# EAGLE design untitled (EAGLE 7.3.0)
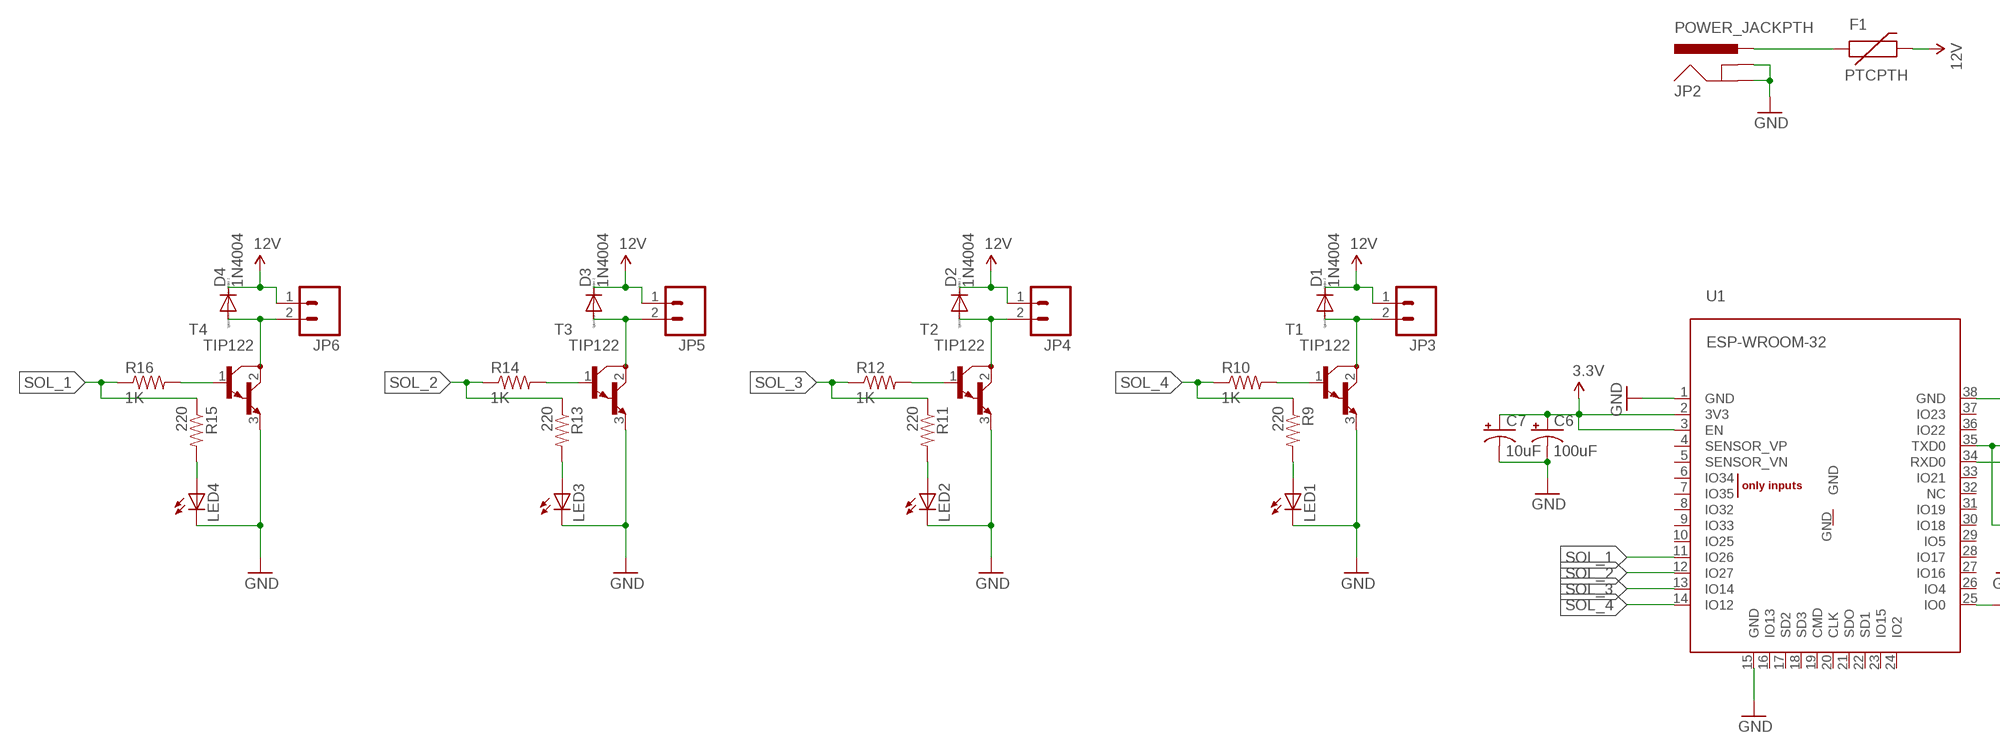
[diagram p0: schematic, sheet 1, part 1 of 2]
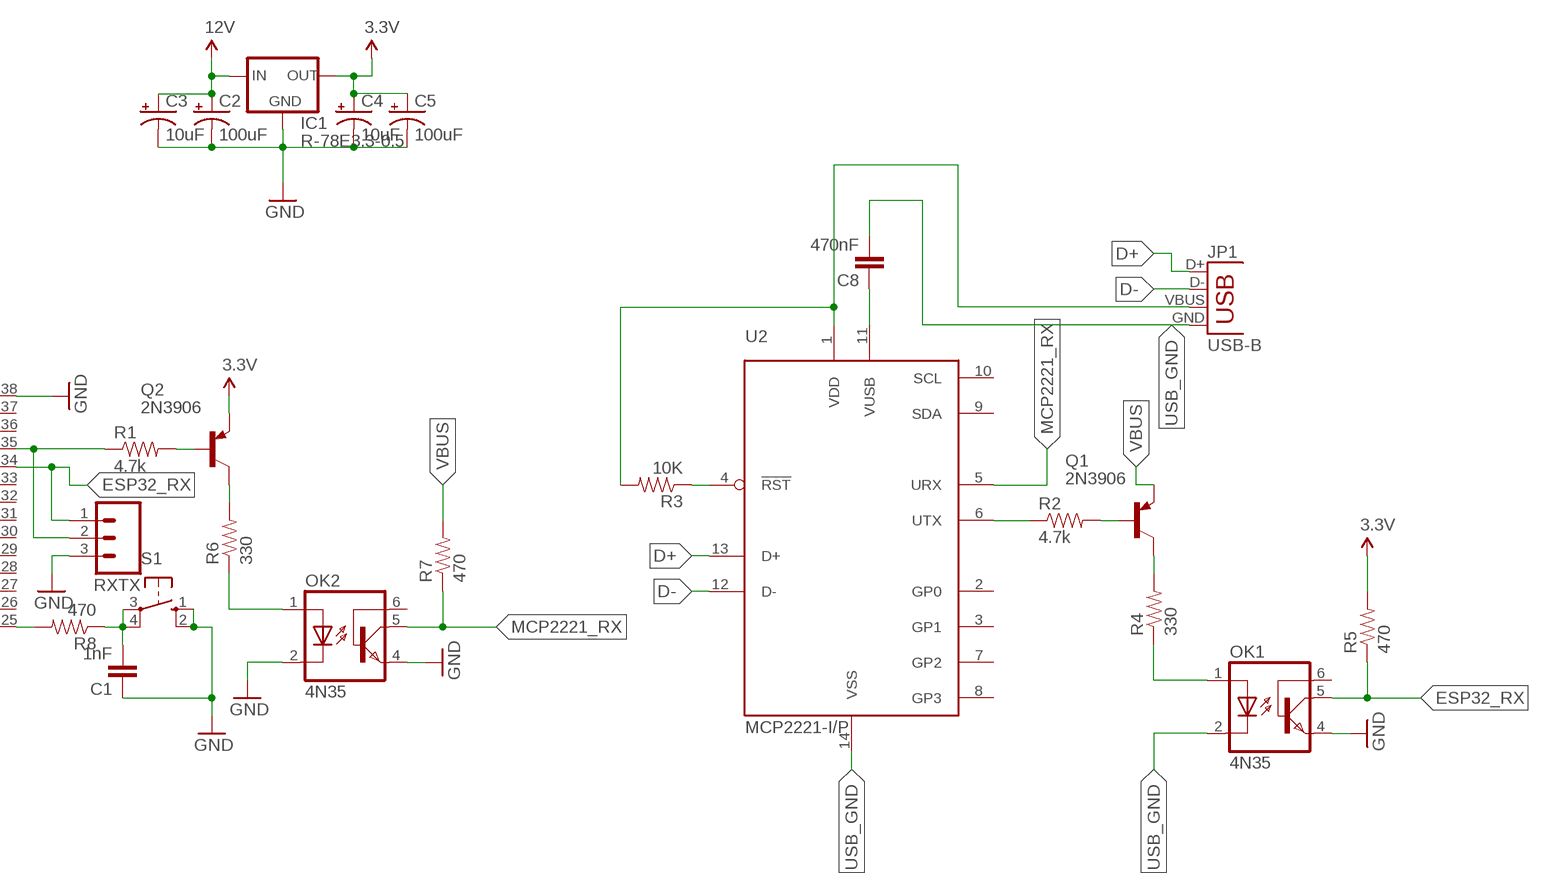
[diagram p1: schematic, sheet 1, part 2 of 2]

## Parts
C1  1nF  CAPKIT  [CAP-PTH-SMALL-KIT]
C2  100uF  CAP_POLPTH1  [CPOL-RADIAL-100UF-25V]
C3  10uF  CAP_POLPTH1  [CPOL-RADIAL-100UF-25V]
C4  10uF  CAP_POLPTH1  [CPOL-RADIAL-100UF-25V]
C5  100uF  CAP_POLPTH1  [CPOL-RADIAL-100UF-25V]
C6  100uF  CAP_POLPTH1  [CPOL-RADIAL-100UF-25V]
C7  10uF  CAP_POLPTH1  [CPOL-RADIAL-100UF-25V]
C8  470nF  CAPEZ  [CAP-PTH-SMALLEZ]
D1  1N4004  [DO41-10]
D2  1N4004  [DO41-10]
D3  1N4004  [DO41-10]
D4  1N4004  [DO41-10]
F1  PTCPTH  [PTC]
IC1  R-78E3.3-0.5  [SIP3]
JP1  USB-B  USBPTH  [USB-B-PTH]
JP2  POWER_JACKPTH  [POWER_JACK_PTH]
JP3  M02LOCK_LONGPADS  [1X02_LOCK_LONGPADS]
JP4  M02LOCK_LONGPADS  [1X02_LOCK_LONGPADS]
JP5  M02LOCK_LONGPADS  [1X02_LOCK_LONGPADS]
JP6  M02LOCK_LONGPADS  [1X02_LOCK_LONGPADS]
LED1  LED3MM  [LED3MM]
LED2  LED3MM  [LED3MM]
LED3  LED3MM  [LED3MM]
LED4  LED3MM  [LED3MM]
OK1  4N35  [DIL06]
OK2  4N35  [DIL06]
Q1  2N3906  [TO92]
Q2  2N3906  [TO92]
R1  4.7k  RESISTORAXIAL-0.3  [AXIAL-0.3]
R2  4.7k  RESISTORAXIAL-0.3  [AXIAL-0.3]
R3  10K  RESISTORAXIAL-0.3  [AXIAL-0.3]
R4  330  RESISTORAXIAL-0.3  [AXIAL-0.3]
R5  470  RESISTORAXIAL-0.3  [AXIAL-0.3]
R6  330  RESISTORAXIAL-0.3  [AXIAL-0.3]
R7  470  RESISTORAXIAL-0.3  [AXIAL-0.3]
R8  470  RESISTORAXIAL-0.3  [AXIAL-0.3]
R9  220  RESISTORAXIAL-0.3  [AXIAL-0.3]
R10  1K  RESISTORAXIAL-0.3  [AXIAL-0.3]
R11  220  RESISTORAXIAL-0.3  [AXIAL-0.3]
R12  1K  RESISTORAXIAL-0.3  [AXIAL-0.3]
R13  220  RESISTORAXIAL-0.3  [AXIAL-0.3]
R14  1K  RESISTORAXIAL-0.3  [AXIAL-0.3]
R15  220  RESISTORAXIAL-0.3  [AXIAL-0.3]
R16  1K  RESISTORAXIAL-0.3  [AXIAL-0.3]
RXTX  M03LONGPADS  [1X03_LONGPADS]
S1  10-XX  [B3F-10XX]
T1  TIP122  [TO220]
T2  TIP122  [TO220]
T3  TIP122  [TO220]
T4  TIP122  [TO220]
U1  ESP-WROOM-32  [ESP-WROOM-32]
U2  MCP2221-I/P  [DIL14]

## Nets
3.3V: C4.1(+) C5.1(+) C6.1(+) C7.1(+) IC1.3(OUT) Q2.3(E) R5.P$2 U1.2(3V3) U1.3(EN)
12V: C2.1(+) C3.1(+) D1.C D2.C D3.C D4.C F1.P$2 IC1.1(IN) JP3.1 JP4.1 JP5.1 JP6.1
D+: JP1.D+ U2.13(D+)
D-: JP1.D- U2.12(D-)
ESP32_RX: OK1.5(COL) R5.P$1 RXTX.1 U1.34(RXD0)
GND: C1.1 C2.2(-) C3.2(-) C4.2(-) C5.2(-) C6.2(-) C7.2(-) IC1.2(GND) JP2.GND JP2.GNDBREAK LED1.K(C) LED2.K(C) LED3.K(C) LED4.K(C) OK1.4(EMI) OK2.2(C) OK2.4(EMI) RXTX.3 S1.1(S) S1.2(S1) T1.3(E) T2.3(E) T3.3(E) T4.3(E) U1.1(GND) U1.15(GND) U1.38(GND)
MCP2221_RX: OK2.5(COL) R7.P$1 U2.5(URX)
N$1: Q1.1(C) R4.P$2
N$2: R1.P$1 RXTX.2 U1.35(TXD0)
N$3: C8.1 U2.11(VUSB)
N$4: Q2.2(B) R1.P$2
N$5: R3.P$1 U2.4(!RST)
N$6: R2.P$1 U2.6(UTX)
N$7: Q1.2(B) R2.P$2
N$8: OK1.1(A) R4.P$1
N$9: Q2.1(C) R6.P$2
N$10: OK2.1(A) R6.P$1
N$12: R8.P$2 U1.25(IO0)
N$13: D1.A JP3.2 T1.2(C)
N$14: LED1.A R9.P$2
N$15: R10.P$2 T1.1(B)
N$16: D2.A JP4.2 T2.2(C)
N$17: LED2.A R11.P$2
N$18: R12.P$2 T2.1(B)
N$19: D3.A JP5.2 T3.2(C)
N$20: LED3.A R13.P$2
N$21: R14.P$2 T3.1(B)
N$22: D4.A JP6.2 T4.2(C)
N$23: LED4.A R15.P$2
N$24: R16.P$2 T4.1(B)
N$25: F1.P$1 JP2.PWR
RXTX: C1.2 R8.P$1 S1.3(P) S1.4(P1)
SOL_1: R15.P$1 R16.P$1 U1.11(IO26)
SOL_2: R13.P$1 R14.P$1 U1.12(IO27)
SOL_3: R11.P$1 R12.P$1 U1.13(IO14)
SOL_4: R9.P$1 R10.P$1 U1.14(IO12)
USB_GND: C8.2 JP1.GND OK1.2(C) U2.14(VSS)
VBUS: JP1.VBUS Q1.3(E) R3.P$2 R7.P$2 U2.1(VDD)
Unconnected: OK1.6(BAS) OK2.6(BAS) U1.4(SENSOR_VP) U1.5(SENSOR_VN) U1.6(IO34) U1.7(IO35) U1.8(IO32) U1.9(IO33) U1.10(IO25) U1.16(IO13) U1.17(SD2) U1.18(SD3) U1.19(CMD) U1.20(CLK) U1.21(SDO) U1.22(SD1) U1.23(IO15) U1.24(IO2) U1.26(IO4) U1.27(IO16) U1.28(IO17) U1.29(IO5) U1.30(IO18) U1.31(IO19) U1.32(NC) U1.33(IO21) U1.36(IO22) U1.37(IO23) U1.GND U2.2(GP0) U2.3(GP1) U2.7(GP2) U2.8(GP3) U2.9(SDA) U2.10(SCL)

## Library data of the parts
C1 = SparkFun:CAP: Capacitor Standard 0603 ceramic capacitor, and 0.1" leaded capacitor.
C2-C7 = SparkFun:CAP_POL: Capacitor Polarized These are standard SMD and PTH capacitors. Normally 10uF, 47uF, and 100uF in electrolytic and tantalum varieties. Always verify the external diameter of the through hole cap, it varies with capacity, voltage, and manufacturer. The EIA devices should be standard.
C8 = SparkFun-Capacitors:CAP: Capacitor Standard 0603 ceramic capacitor, and 0.1" leaded capacitor.; MF: MULTICOMP; MPN: MCBU5471K5; OC_FARNELL: 9411771
D1-D4 = diode:1N4004: DIODE general purpose rectifier, 1 A
F1 = SparkFun:PTC: Resettable Fuse PTC Resettable Fuse. Spark Fun Electronics SKU : COM-08357
IC1 = r-78xx_10:R-78E*-0.5: Innoline R-78xx-0.5 Series Switching Regulators - 0.5A, Low Cost Source: http://www.recom-international.com/pdf/Innoline/R-78Exx-0.5.pdf; MF: Recom; MPN: R-783.3-0.5; OC_FARNELL: unknown; OC_NEWARK: 62X9498
JP1 = SparkFun-Connectors:USB: USB Connectors USB-B-PTH is fully proven SKU : PRT-00139/CONN-08278 USB-miniB is fully proven SKU : PRT-00587 USB-A-PCB is untested. USB-A-H is throughly reviewed, but untested. Spark Fun Electronics SKU : PRT-00437 USB-B-SMT is throughly reviewed, but untested. Needs silkscreen touching up. USB-A-S has not been used/tested USB-MB-H has not been used/tested USB-MICROB has been used. CONN-09505; MF: MULTICOMP; MPN: USB-B-S-RA.; OC_FARNELL: 1626770; PROD_ID: CONN-08278
JP2 = SparkFun-Connectors:POWER_JACK: Power Jack This is the standard 5.5mm barrel jack for power. The PTH is the most common, proven, reliable, footprint. The Slot footprint only works if the mill layer is transmitted to the PCB fab house so be warned. Mating wall wart : TOL-00298 (and others); MF: CLIFF ELECTRONIC COMPONENTS; MPN: DC10A; OC_FARNELL: 224959; PROD_ID: CONN-08197
JP3-JP6 = SparkFun:M02: Header 2 Standard 2-pin 0.1" header. Use with straight break away headers (SKU : PRT-00116), right angle break away headers (PRT-00553), swiss pins (PRT-00743), machine pins (PRT-00117), and female headers (PRT-00115). Molex polarized connector foot print use with SKU : PRT-08233 with associated crimp pins and housings.
LED1-LED4 = SparkFun:LED: LEDs Standard schematic elements and footprints for 5mm, 3mm, 1206, and 0603 sized LEDs. 5mm - Spark Fun Electronics SKU : COM-00529 (and others)
OK1 OK2 = optocoupler:4N35: MOTOROLA OPTO COUPLER; MF: VISHAY; MPN: 4N35; OC_FARNELL: 1328375; OC_NEWARK: 72K9946
Q1 Q2 = transistor-pnp:2N3906: PNP Transistor; MF: MULTICOMP; MPN: 2N3906; OC_FARNELL: 1574372
R1 R2 = SparkFun-Resistors:RESISTOR: Resistor Basic schematic elements and footprints for 0603, 1206, and PTH resistors.; MF: MULTICOMP; MPN: MCRE000045; OC_FARNELL: 1700245
R3 = SparkFun-Resistors:RESISTOR: Resistor Basic schematic elements and footprints for 0603, 1206, and PTH resistors.; MF: MULTICOMP; MPN: MCMF006FF1002A50; OC_FARNELL: 2401780
R4 R6 = SparkFun-Resistors:RESISTOR: Resistor Basic schematic elements and footprints for 0603, 1206, and PTH resistors.; MF: MULTICOMP; MPN: MCRE000031; OC_FARNELL: 1700230
R5 R7-R16 = SparkFun-Resistors:RESISTOR: Resistor Basic schematic elements and footprints for 0603, 1206, and PTH resistors.; MF: MULTICOMP; MPN: MCRE000033; OC_FARNELL: 1700232
RXTX = SparkFun:M03: Header 3 Standard 3-pin 0.1" header. Use with straight break away headers (SKU : PRT-00116), right angle break away headers (PRT-00553), swiss pins (PRT-00743), machine pins (PRT-00117), and female headers (PRT-00115). Molex polarized connector foot print use with SKU : PRT-08232 with associated crimp pins and housings.
S1 = switch-omron:10-XX: OMRON SWITCH; MPN: B3F-1000; OC_FARNELL: 176432; OC_NEWARK: 36M3542
T1-T4 = transistor:TIP122: NPN BIPOLAR DARLINGTON TRANSISTOR
U1 = esp32:ESP-WROOM-32
U2 = microchip-mcp2221:MCP2221-*: MCP2221 in PDIP, SOIC and TSSOP package The MCP2221 is a USB-to-UART/I2C serial converter which enables USB connectivity in applications that have a UART and I2C interfaces. The device reduces external components by integrating the USB termination resistors and the oscillator needed for USB operation. The MCP2221 also has four GP pins providing miscellaneous functionalities (GPIO, USBCFG, SSPND, Clock Output, ADC, DAC, interrupt detector). Source: www.microchip.com/MCP2221 <http://www.microchip.com/wwwproducts/Devices.aspx?product=MCP2221> and www.microchipdirect.com <http://www.microchipdirect.com/ProductDetails.aspx?Category=MCP2221> Tutorial: MCP2221 by Arnauld Biganzoli <https://docs.google.com/document/d/1P3zzqCKdEXzCe--1Yyg8PClCZKsUri8pyNO7AV2daaw/edit?usp=sharing>; MF: MICROCHIP; MPN: MCP2221-I/P; OC_FARNELL: 2434892

## Board
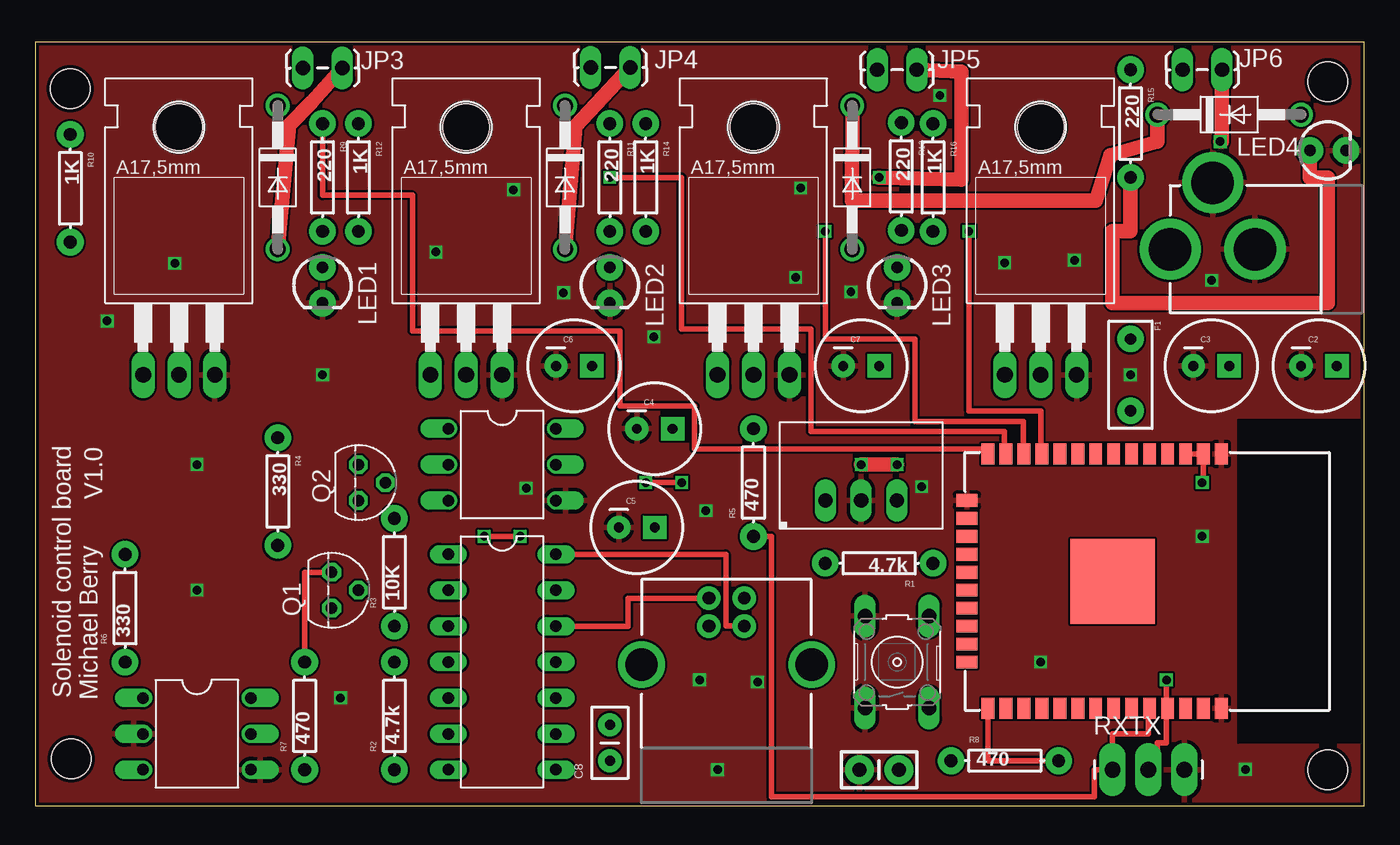
[diagram p2: board, top side]
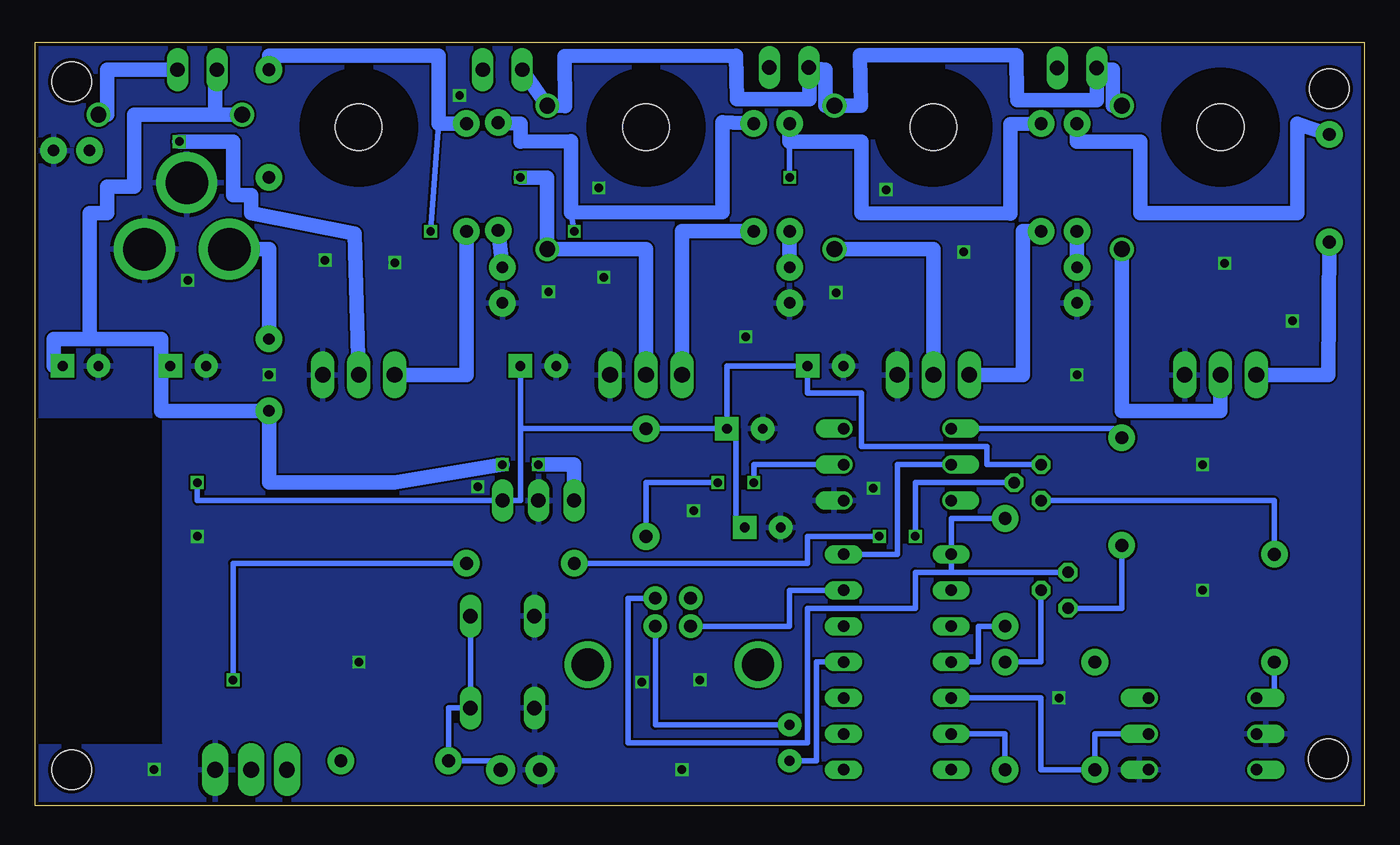
[diagram p3: board, bottom side, seen from below]

Size 94 x 54 mm. Coordinates in mm from the lower left corner, seen from the top.
Outline: 0,0 94,0 94,54 0,54 0,0
Copper layers (1*16): Top 0.035mm / dielectric 1.5mm / Bottom 0.035mm
Design rules "SeeedStudio_2layer_DRU_no_angle_20140221": minimum track width 6mil, minimum drill 12mil, track to track 6mil, track to pad 6mil, pad to pad 6mil, via to via 6mil, smd to smd 0mil, copper to edge 10mil, drill to drill 10mil, minimum pad ring 10mil, minimum via ring 6mil, stop-mask expansion 2mil, vias tented up to drill 100mil, thermal gap 10mil
Holes 2.8 mm at 2.47,50.74 2.54,3.31 91.44,2.54 91.44,51.23

### Footprints (pad centres in the part's own frame; a part is rotated, then mirrored left to right if it is on the bottom)
CAP-PTH-SMALL-KIT = drill 1.016 pad 2.032: 1 -1.397,0; 2 1.397,0
CPOL-RADIAL-100UF-25V = drill 0.7 pad 1.651 square: 1 1.27,0 | drill 0.7 pad 1.651: 2 -1.27,0
CAP-PTH-SMALLEZ = drill 0.7 pad 1.651: 1 0,0; 2 2.54,0
DO41-10 = drill 1.118: A 5.08,0; C -5.08,0
PTC = drill 0.8 pad 1.88: P$1 -2.54,0; P$2 2.54,0
SIP3 = drill 1 long: 1 -2.54,0; 2 0,0; 3 2.54,0
USB-B-PTH = drill 0.914 pad 1.676: D+ 0,1.25; D- 1.981,1.25; GND 0,-1.25; VBUS 1.981,-1.25 | drill 2.286: S1 -2.718,-6.02; S2 -2.718,6.02
POWER_JACK_PTH = drill 2.997 pad 4.318: GND 0,7.7; GNDBREAK 4.7,10.7; PWR 0,13.7
1X02_LOCK_LONGPADS = drill 1.016 long: 1 -0.127,0; 2 2.667,0
LED3MM = drill 0.813 pad 1.88: A -1.27,0; K 1.27,0
DIL06 = drill 0.813 offset: 1 -2.54,-3.81; 2 0,-3.81; 3 2.54,-3.81; 4 2.54,3.81; 5 0,3.81; 6 -2.54,3.81
TO92 = drill 0.813 octagon: 1 1.27,0; 2 0,1.905; 3 -1.27,0
AXIAL-0.3 = drill 0.9 pad 1.88: P$1 -3.81,0; P$2 3.81,0
1X03_LONGPADS = drill 1.118 pad 1.88 long: 1 0,0; 2 2.54,0; 3 5.08,0
B3F-10XX = drill 1.016 long: 1 -3.251,2.261; 2 3.251,2.261; 3 -3.251,-2.261; 4 3.251,-2.261
TO220 = drill 1.118 long: 1 -2.54,-6.35; 2 0,-6.35; 3 2.54,-6.35 | hole 3.302: 0,11.176
ESP-WROOM-32 = smd 0.9 x 1.5: 1 7.7,9; 2 6.43,9; 3 5.16,9; 4 3.89,9; 5 2.62,9; 6 1.35,9; 7 0.08,9; 8 -1.19,9; 9 -2.46,9; 10 -3.73,9; 11 -5,9; 12 -6.27,9; 13 -7.54,9; 14 -8.81,9; 25 -8.81,-9; 26 -7.54,-9; 27 -6.27,-9; 28 -5,-9; 29 -3.73,-9; 30 -2.46,-9; 31 -1.19,-9; 32 0.08,-9; 33 1.35,-9; 34 2.62,-9; 35 3.89,-9; 36 5.16,-9; 37 6.43,-9; 38 7.7,-9 | smd 1.5 x 0.9: 15 -10.3,5.715; 16 -10.3,4.445; 17 -10.3,3.175; 18 -10.3,1.905; 19 -10.3,0.635; 20 -10.3,-0.635; 21 -10.3,-1.905; 22 -10.3,-3.175; 23 -10.3,-4.445; 24 -10.3,-5.715 | smd 6 x 6: GND 0,0
DIL14 = drill 0.813 long: 1 -7.62,-3.81; 2 -5.08,-3.81; 3 -2.54,-3.81; 4 0,-3.81; 5 2.54,-3.81; 6 5.08,-3.81; 7 7.62,-3.81; 8 7.62,3.81; 9 5.08,3.81; 10 2.54,3.81; 11 0,3.81; 12 -2.54,3.81; 13 -5.08,3.81; 14 -7.62,3.81

### Placement (x,y rotation side)
C1  59.69,2.54 0 top
C2  90.81,31.11 0 top
C3  83.19,31.11 0 top
C4  43.81,26.67 0 top
C5  42.55,19.68 0 top
C6  38.1,31.11 0 top
C7  58.42,31.11 0 top
C8  40.64,3.17 90 top
D1  17.14,44.45 270 top
D2  37.47,44.45 270 top
D3  57.78,44.45 270 top
D4  84.45,48.9 0 top
F1  77.47,30.48 270 top
IC1  58.42,21.59 0 top
JP1  48.9,12.7 90 top
JP2  93.98,39.37 90 top
JP3  19.05,52.19 0 top
JP4  39.41,52.22 0 top
JP5  59.69,52.07 0 top
JP6  81.28,52.07 0 top
LED1  20.32,36.83 270 top
LED2  40.64,36.83 270 top
LED3  60.96,36.83 270 top
LED4  91.44,46.35 0 top
OK1  33.02,24.13 270 top
OK2  11.43,5.08 270 top
Q1  20.95,15.24 270 top
Q2  22.86,22.86 270 top
R1  59.69,17.14 180 top
R2  25.4,6.35 90 top
R3  25.4,16.51 90 top
R4  17.14,22.23 270 top
R5  50.8,22.86 90 top
R6  6.35,13.97 90 top
R7  19.05,6.35 90 top
R8  68.58,3.17 0 top
R9  20.32,44.45 270 top
R10  2.47,43.68 270 top
R11  40.64,44.45 270 top
R12  22.86,44.45 270 top
R13  61.26,44.52 270 top
R14  43.18,44.45 270 top
R15  77.47,48.26 270 top
R16  63.5,44.45 270 top
RXTX  76.2,2.54 0 top
S1  60.96,10.16 90 top
T1  10.16,36.83 0 top
T2  30.48,36.83 0 top
T3  50.8,36.83 0 top
T4  71.12,36.83 0 top
U1  76.2,15.88 0 top
U2  33.02,10.16 270 top

### Tracks (layer width: path | path; a pad name or v marks a point on that pad's centre or on a via)
3.3V  (via drill 0.6)
  Top 0.406: v82.55,22.86 82.63,22.86 U1.2 U1.3
  Bottom 0.406: C4.1 45.09,31.11 C6.1 39.37,29.21 35.56,29.21 35.56,25.4 26.67,25.4 26.67,24.13 Q2.3 | C4.1 44.45,26.67 44.45,20.32 43.81,20.32 C5.1 | C4.1 R5.P$2 59.69,26.67 | v82.55,22.86 82.55,21.59 IC1.3 59.69,21.59 59.69,26.67 | 59.69,26.67 C7.1
12V  (via drill 0.6)
  Top 1.016: v58.42,24.13 v60.96,24.13 | D4.C 79.38,46.99 76.06,46.02 75.02,42.82 57.77,42.82 D3.C
  Bottom 1.016: C3.1 85.09,31.11 | 85.09,31.11 85.09,27.94 F1.P$2 77.47,22.86 68.58,22.86 v60.96,24.13 | C2.1 92.71,31.11 92.71,33.02 90.17,33.02 | 90.17,33.02 85.09,33.02 85.09,31.11 | JP6.1 81.28,52.07 81.28,48.9 D4.C 87,48.9 87,43.81 88.9,43.81 88.9,41.91 90.17,41.91 90.17,33.02 | D1.C 17.78,49.53 17.78,52.07 JP3.1 18.92,49.9 24.52,49.9 24.52,50.19 24.56,50.19 24.61,53.08 35.66,53.08 35.61,49.53 D2.C 38.1,49.53 38.1,52.07 JP4.1 39.24,49.97 44.38,49.97 44.43,53.05 56.57,53.02 56.52,49.5 D3.C JP5.1 | IC1.1 55.88,24.13 v58.42,24.13
D+
  Bottom 0.406: JP1.D+ 40.64,12.7 40.64,15.24 U2.13
D-
  Top 0.406: JP1.D- 41.91,14.68 41.91,12.7 U2.12
ESP32_RX  (via drill 0.6)
  Top 0.406: U1.34 78.74,6.88 78.74,5.08 76.2,5.08 RXTX.1 74.93,2.54 74.93,0.64 52.07,0.64 52.07,19.05 R5.P$1 | v43.18,22.86 v45.72,22.86
  Bottom 0.406: OK1.5 43.18,24.13 v43.18,22.86 | v45.72,22.86 50.8,22.86 R5.P$1
GND  (via drill 0.6)
  other vias: 11.43,24.13 11.43,15.24 5.08,34.29 20.32,30.48 21.59,7.62 46.99,8.89 48.26,2.54 71.12,10.16 82.55,19.05 77.47,30.48 57.7,36.36 43.75,33.17 37.36,36.3 83.22,37.16 85.6,2.57 68.56,38.42 73.5,38.59 53.79,37.38 28.33,39.17 9.86,38.37 47.44,20.87 34.72,22.46 62.7,22.56 51.09,8.75 33.82,43.58 54.14,43.71 63.99,50.25
  pour Bottom: -5.08,57.15 99.06,57.15 99.06,-2.54 -5.08,-2.54
  pour Top: -7.62,62.23 102.87,62.23 102.87,-7.62 -7.62,-7.62
MCP2221_RX
  Bottom 0.406: OK2.5 19.05,5.08 R7.P$1 22.86,2.54 22.86,7.62 U2.5
N$1
  Bottom 0.406: Q1.1 17.14,13.97 R4.P$2
N$2  (via drill 0.6)
  Top 0.406: U1.35 80.01,6.88 | 80.01,6.88 80.01,6.35 80.01,4.45 79.38,4.45 79.38,3.81 78.74,3.81 RXTX.2 | v80.01,8.89 80.01,6.88
  Bottom 0.406: R1.P$1 80.01,17.14 v80.01,8.89
N$3
  Bottom 0.406: C8.1 38.73,3.17 38.73,10.16 U2.11
N$4  (via drill 0.6)
  Top 0.406: v31.75,19.05 v34.29,19.05
  Bottom 0.406: Q2.2 31.75,22.86 v31.75,19.05 | v34.29,19.05 39.37,19.05 39.37,17.14 R1.P$2
N$5
  Bottom 0.406: U2.4 27.3,10.16 27.3,12.7 R3.P$1
N$6
  Bottom 0.406: R2.P$1 25.4,5.08 U2.6
N$7
  Bottom 0.406: R2.P$2 22.86,10.16 Q1.2
N$8
  Bottom 0.406: R4.P$1 17.78,26.04 17.78,26.67 OK1.1
N$9
  Bottom 0.406: R6.P$2 6.35,21.59 Q2.1
N$10
  Bottom 0.406: OK2.1 6.35,7.62 R6.P$1
N$12
  Top 0.406: R8.P$2 67.39,3.17 U1.25
N$13
  Top 1.016: JP3.2 19.55,49.79 17.97,48.14 D1.A
  Bottom 1.016: T1.2 10.16,27.94 17.14,27.94 D1.A
N$14
  Bottom 1.016: LED1.A R9.P$2
N$15
  Bottom 1.016: T1.1 2.54,30.48 R10.P$2
N$16
  Top 1.016: JP4.2 38.22,48.07 D2.A
  Bottom 1.016: T2.2 30.48,39.37 D2.A
N$17
  Bottom 1.016: R11.P$2 LED2.A
N$18
  Bottom 1.016: T2.1 24.13,30.48 24.13,40.64 R12.P$2
N$19  (via drill 0.6)
  Top 1.016: JP5.2 65.51,51.92 65.51,44.3 v59.69,44.45
  Bottom 1.016: T3.2 50.8,39.37 D3.A 57.78,44.45 v59.69,44.45
N$20
  Bottom 1.016: LED3.A R13.P$2
N$21
  Bottom 1.016: R14.P$2 48.26,40.64 T3.1
N$22  (via drill 0.6)
  Top 1.016: v83.82,46.99 83.95,46.99 JP6.2
  Bottom 1.016: JP6.2 88.9,52.07 88.9,48.9 D4.A | T4.2 71.4,40.46 78.74,41.91 78.74,43.18 80.01,43.18 80.01,46.99 v83.82,46.99
N$23
  Top 1.016: LED4.A 90.17,44.45 91.44,44.45 91.44,35.56 76.2,35.56 76.2,40.64 77.47,40.64 R15.P$2
N$24
  Bottom 1.016: R16.P$2 63.5,30.48 T4.1
N$25
  Bottom 1.016: F1.P$1 77.47,39.37 JP2.PWR
RXTX
  Bottom 0.406: C1.2 61.09,3.17 R8.P$1 64.77,6.91 S1.3 S1.4
SOL_1  (via drill 0.6)
  Top 0.406: U1.11 71.12,24.88 71.12,27.94 66.04,27.94 v66.04,40.64
  Bottom 0.406: v66.04,40.64 65.46,48.26
  Bottom 1.016: R16.P$1 65.46,48.26 65.46,53.05 77.47,53.05 R15.P$1
SOL_2  (via drill 0.6)
  Top 0.406: U1.12 69.89,24.88 69.89,27.17 62.23,27.17 62.23,33.02 55.88,33.02 v55.88,40.64
  Bottom 0.406: v55.88,40.64 56.12,41.94
  Bottom 1.016: R13.P$1 59.69,48.26 59.69,46.99 56.12,47.02 56.12,41.94 45.38,42.01 45.38,48.36 R14.P$1
SOL_3  (via drill 0.6)
  Top 0.406: U1.13 68.55,24.88 68.55,26.48 54.86,26.48 54.86,33.71 45.72,33.71 45.72,44.45 v40.64,44.45
  Bottom 0.406: v40.64,44.45 40.64,46.99
  Bottom 1.016: R12.P$1 25.03,48.23 25.03,41.88 35.56,41.91 35.56,46.99 40.64,46.99 R11.P$1
SOL_4
  Top 0.406: U1.14 67.31,24.88 67.29,25.24 46.62,25.24 46.64,28.27 41.34,28.27 41.34,33.59 26.67,33.59 26.67,43.18 20.32,43.18 R9.P$1
  Bottom 1.016: R10.P$1 4.74,48.26 4.74,41.91 15.82,41.91 15.82,46.99 20.32,46.99 R9.P$1
USB_GND
  Top 0.406: U2.14 48.85,17.78 48.85,12.72 50.15,12.72 JP1.GND
  Bottom 0.406: C8.2 50.15,5.71 JP1.GND | OK1.2 33.02,24.13 33.02,17.78 U2.14
VBUS
  Top 0.406: R7.P$2 19.05,16.51 Q1.3
  Bottom 0.406: Q1.3 29.21,16.51 | 29.21,16.51 U2.1 29.21,20.32 R3.P$2 | JP1.VBUS 52.07,14.68 52.07,4.45 39.37,4.45 39.37,13.97 31.75,13.97 31.75,16.51 29.21,16.51

### Text on the board
tPlace: V1.0 | Solenoid control board | Michael Berry